# EAGLE design Final Power Supply Design PCB (EAGLE 9.6.2)
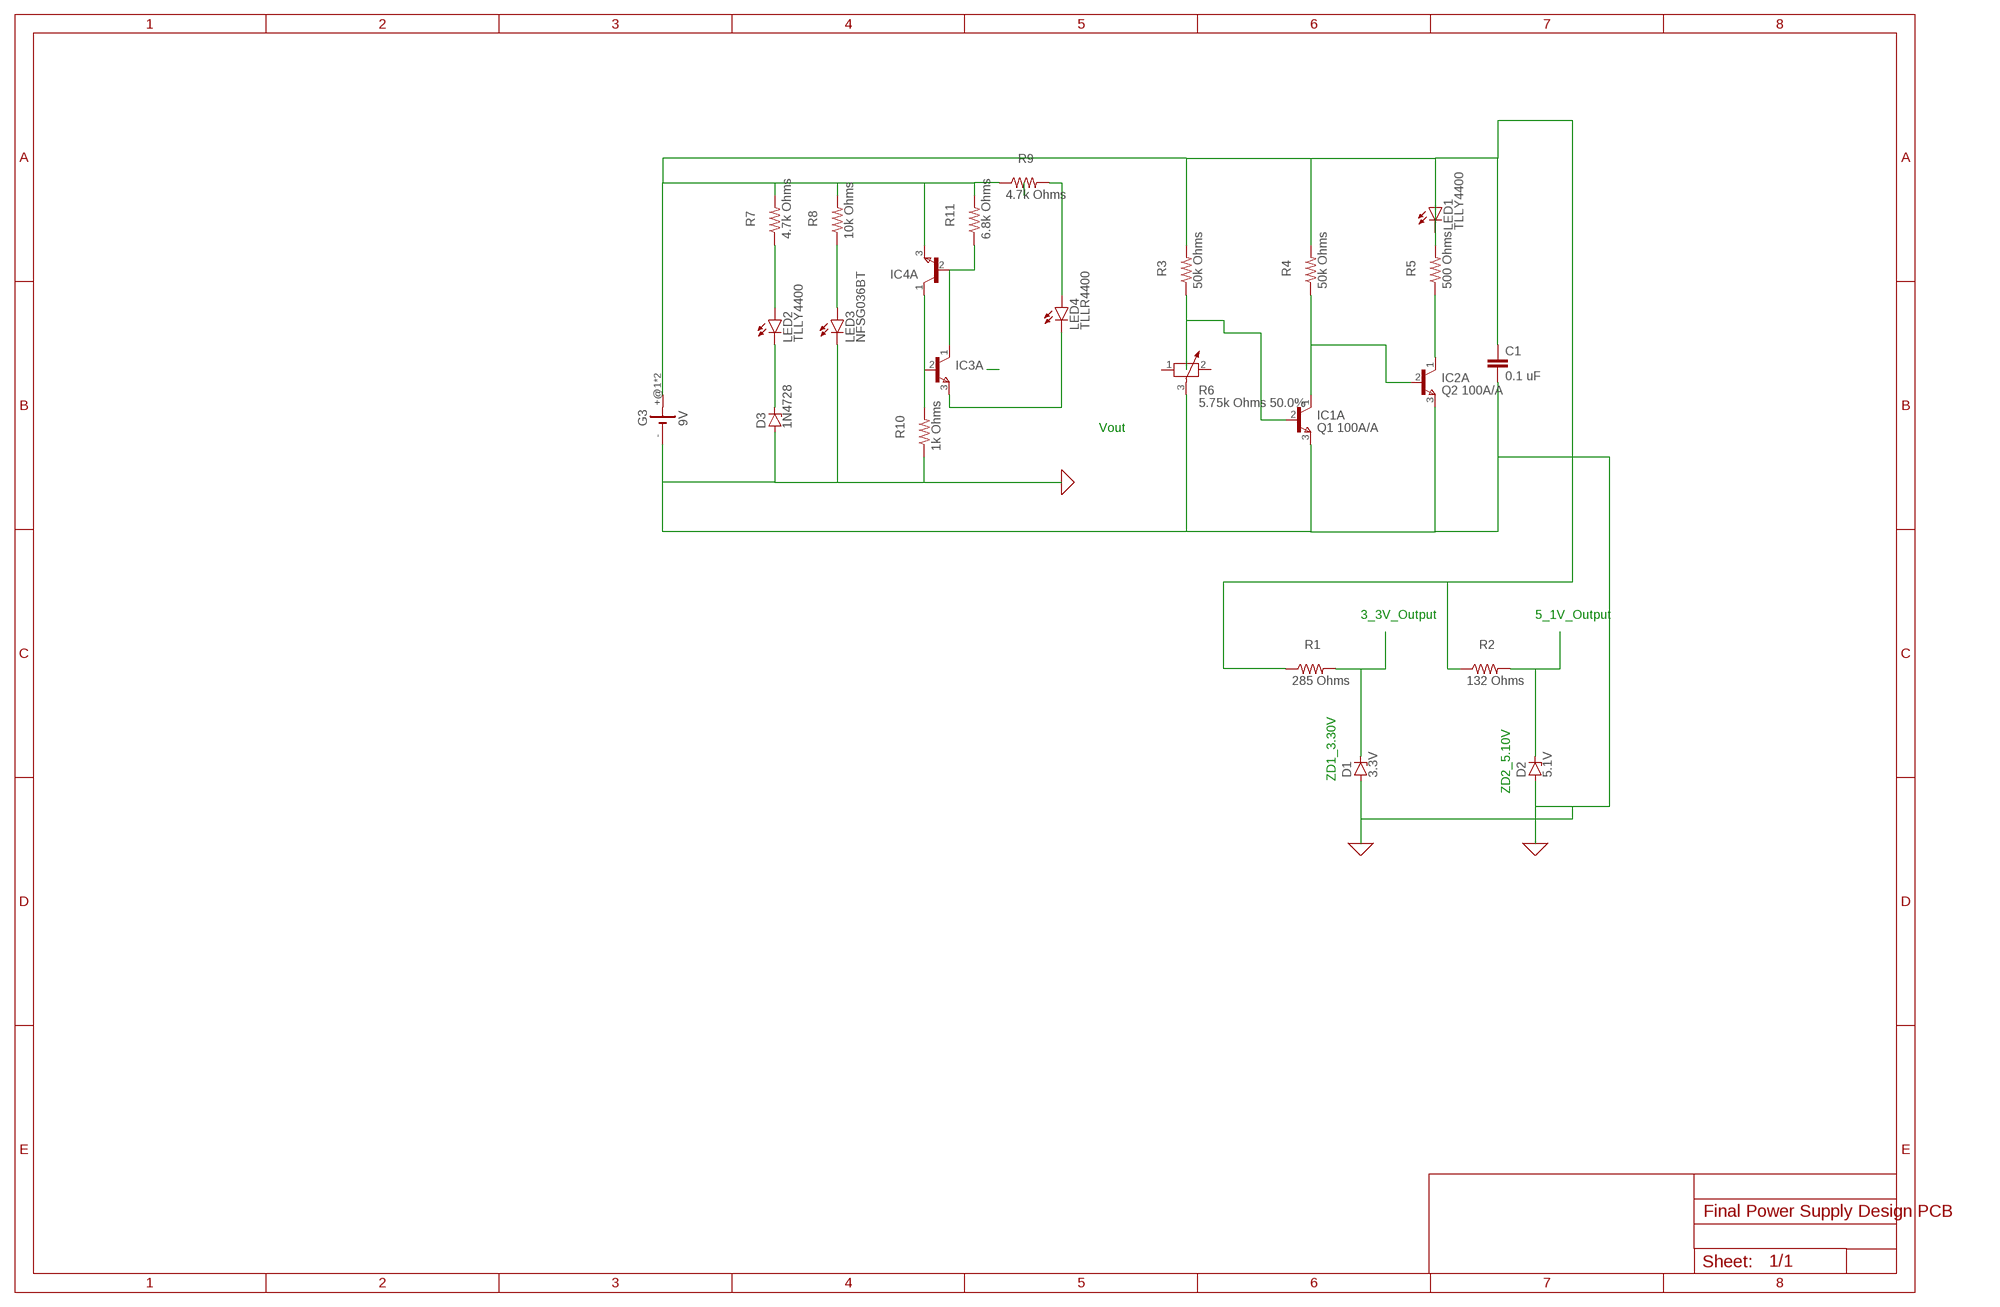
[diagram p0: schematic, sheet 1]

## Parts
C1  0.1 uF  C2.5/4  [C2.5-4]
D1  3.3V  1N4728  [DO41Z10]
D2  5.1V  1N4728  [DO41Z10]
D3  1N4728  [DO41Z10]
G3  9V  10MM_SM_COIN_CELL_CLIP  [10MM_SM_COIN_CELL_CLIP]
IC1  Q1 100A/A  MAT-01H  [TO78]
IC2  Q2 100A/A  MAT-01H  [TO78]
IC3  MAT-01H  [TO78]
IC4  MAT-01H  [TO78]
LED1  TLLY4400  [LED3MM]
LED2  TLLY4400  [LED3MM]
LED3  NFSG036BT  [NFSG036BT]
LED4  TLLR4400  [LED3MM]
R1  285 Ohms  R-US_0204/2V  [0204V]
R2  132 Ohms  R-US_0204/2V  [0204V]
R3  50k Ohms  R-US_0204/2V  [0204V]
R4  50k Ohms  R-US_0204/2V  [0204V]
R5  500 Ohms  R-US_0204/2V  [0204V]
R6  5.75k Ohms 50.0%  POTENTIOMETER_PT-10  [PT-10]
R7  4.7k Ohms  R-US_0204/2V  [0204V]
R8  10k Ohms  R-US_0204/2V  [0204V]
R9  4.7k Ohms  R-US_0204/2V  [0204V]
R10  1k Ohms  R-US_0204/2V  [0204V]
R11  6.8k Ohms  R-US_0204/2V  [0204V]

## Nets
0: C1.2 D1.A D2.A D3.A G3.- IC1.3(A:E) IC2.3(A:E) LED3.C R6.3 R10.1 ; supply symbol labelled GND
N$1: D2.C R2.2
N$2: C1.1 G3.+@1(+) G3.+@2(+) IC4.3(A:E) LED1.A LED1.K(C) R1.1 R2.1 R3.2 R4.2 R5.2 R7.2 R8.2 R9.1 R11.2
N$3: IC1.2(A:B) R3.1
N$5: IC1.1(A:C) IC2.2(A:B) R4.1
N$6: IC2.1(A:C) R5.1
N$7: LED2.A R7.1
N$8: LED3.A R8.1
N$10: D3.C LED2.K(C)
N$11: LED4.A R9.2
N$12: IC3.2(A:B) IC4.1(A:C) R10.2
N$13: IC3.1(A:C) IC4.2(A:B) R11.1
N$14: IC3.3(A:E) LED4.K(C)
N$15: D1.C R1.2
Unconnected: IC1.4(B:E) IC1.5(B:B) IC1.6(B:C) IC2.4(B:E) IC2.5(B:B) IC2.6(B:C) IC3.4(B:E) IC3.5(B:B) IC3.6(B:C) IC4.4(B:E) IC4.5(B:B) IC4.6(B:C) R6.1 R6.2

## Notes on the sheet
- Vout
- 3_3V_Output | 5_1V_Output
- ZD1_3.30V
- ZD2_5.10V

## Library data of the parts
C1 = capacitor-wima:C: CAPACITOR naming: grid - package width
D1-D3 = diode:1N4728: Z DIODE 3.3 V, 1W, 5 percent
G3 = battery:10MM_SM_COIN_CELL_CLIP: Battery cell clip for CR927 Source: KEYSTONE ELECTRONICS CORP. www.keyelco.com, ASTORIA, N.Y. 11105-2017 PART ANME 10mm SM COIN CELl CLIP DWG NO. 3030
IC1-IC4 = linear:MAT-01H: Dual TRANSISTOR
LED1 LED2 = led:TLLY4400: Low Current (2mA) LED 3 mm Tinted Diffused Package color YELLOW Source: Data sheet <http://www.farnell.com/datasheets/391098.pdf>; MF: VISHAY SEMICONDUCTOR; OC_FARNELL: 1612439
LED3 = led:NFSG036BT: CHIP TYPE GREEN LED NFSx036xT Source: NICHIA CORPORATION .. NFSG036BT-E.pdf
LED4 = led:TLLR4400: Low Current (2mA) LED 3 mm Tinted Diffused Package color RED Source: Data sheet <http://www.farnell.com/datasheets/391100.pdf>; MF: VISHAY SEMICONDUCTOR; OC_FARNELL: 1612437
R1-R5 R7-R11 = rcl:R-US_: RESISTOR, American symbol; SPICEPREFIX: R
R6 = rcl:POTENTIOMETER_: Potentiometer; SPICEMODEL: POT; SPICEPREFIX: X

## Board
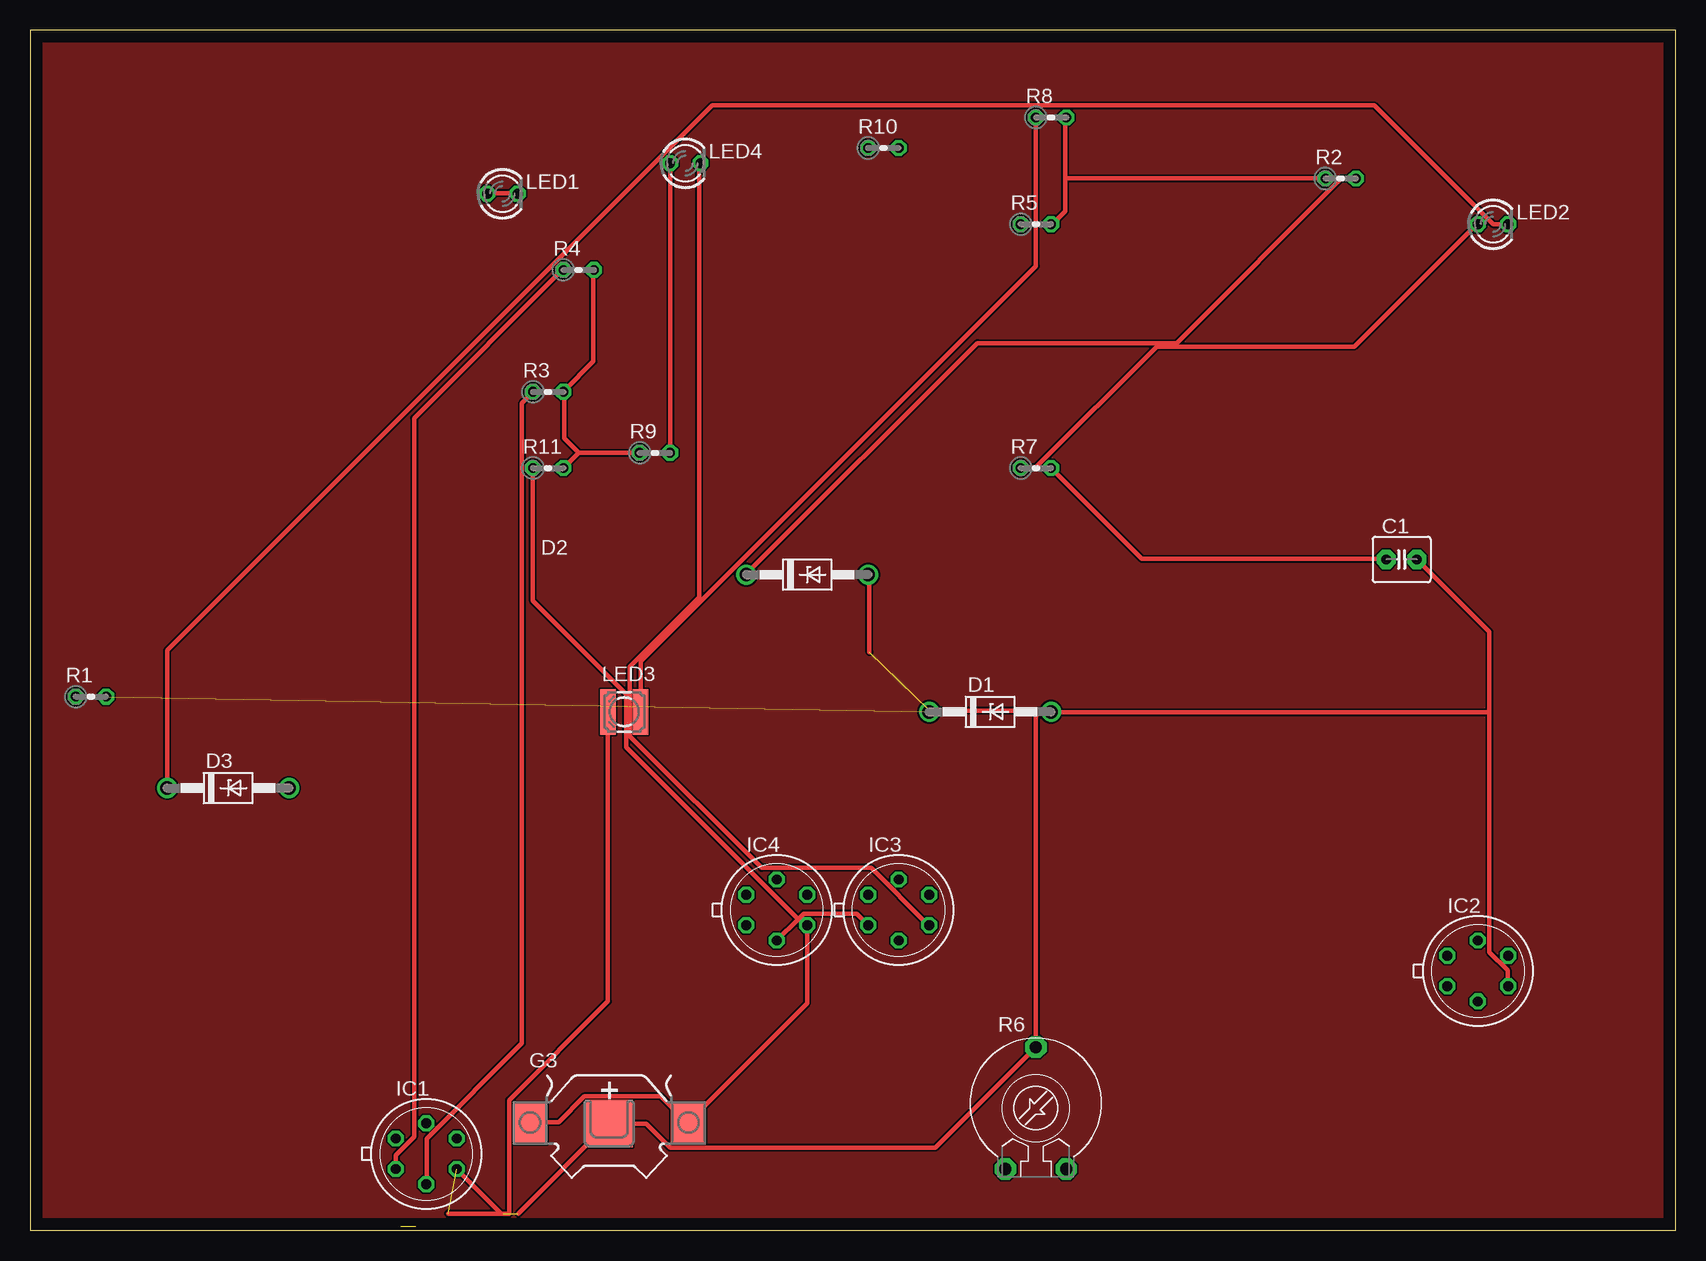
[diagram p1: board, top side]
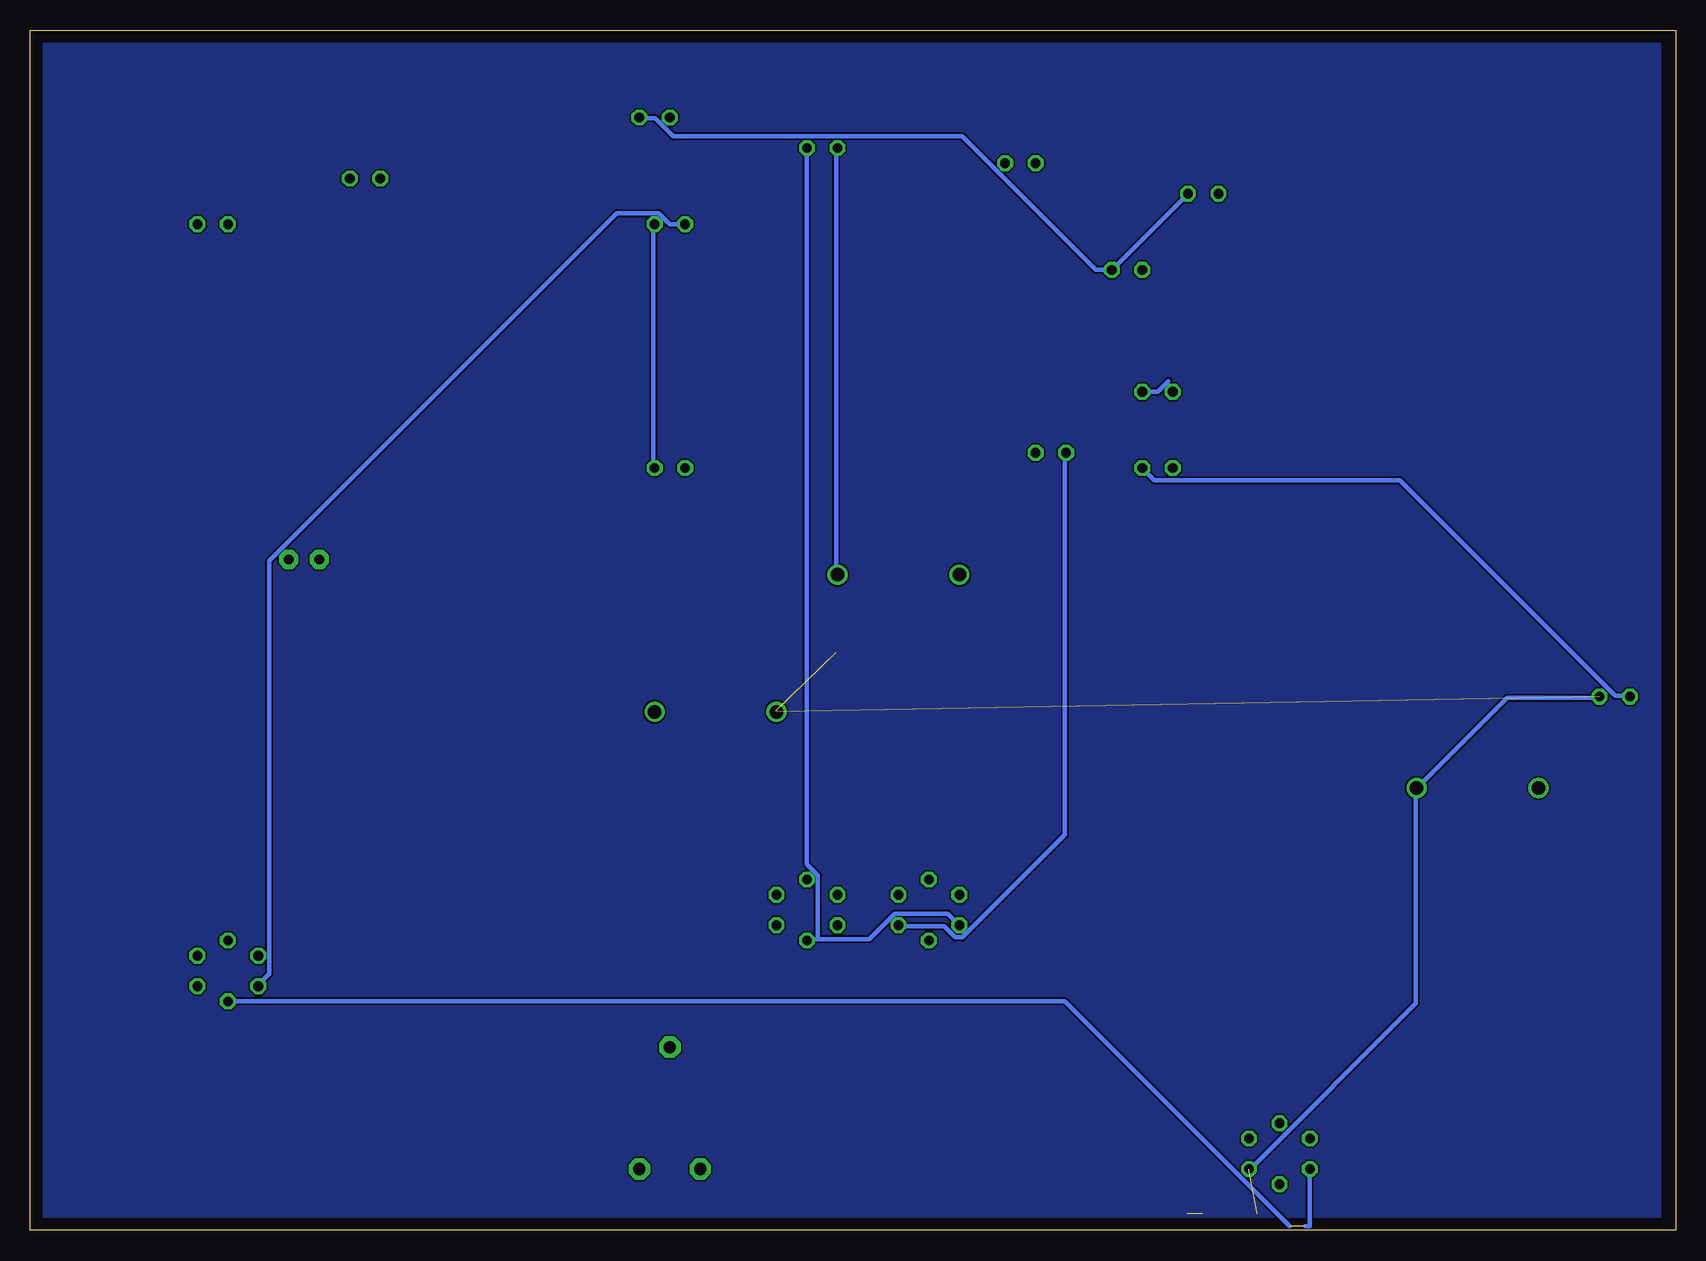
[diagram p2: board, bottom side, seen from below]

Size 137.14 x 100 mm. Coordinates in mm from the lower left corner, seen from the top.
Outline: 0,0 137.14,0 137.14,100 0,100 0,0
Copper layers (1*16): Top 0.035mm / dielectric 1.5mm / Bottom 0.035mm
Design rules "default": minimum track width 6mil, minimum drill 0.35mm, track to track 6mil, track to pad 6mil, pad to pad 6mil, via to via 6mil, smd to smd 6mil, copper to edge 40mil, drill to drill 6mil, minimum pad ring 10mil, minimum via ring 8mil, stop-mask expansion 4mil, vias tented up to drill 0mil, thermal gap 10mil

### Footprints (pad centres in the part's own frame; a part is rotated, then mirrored left to right if it is on the bottom)
C2.5-4 = drill 0.813 pad 1.6 octagon: 1 -1.27,0; 2 1.27,0
DO41Z10 = drill 1.118: A 5.08,0; C -5.08,0
10MM_SM_COIN_CELL_CLIP = smd 2.9 x 3.5: +@1 -6.6,0; +@2 6.6,0 | smd 3.96 x 3.96: - 0,0
TO78 = drill 0.813 octagon: 1 -2.54,-1.27; 2 0,-2.54; 3 2.54,-1.27; 4 2.54,1.27; 5 0,2.54; 6 -2.54,1.27
LED3MM = drill 0.813 octagon: A -1.27,0; K 1.27,0
NFSG036BT = smd 1.3 x 3.8: A 1.35,0; C -1.35,0
0204V = drill 0.813 octagon: 1 -1.27,0; 2 1.27,0
PT-10 = drill 1.016 pad 1.778 octagon: 1 -2.54,-5.08; 2 2.54,-5.08; 3 0,5.08

### Placement (x,y rotation side)
C1  114.3,55.88 0 top
D1  80.01,43.18 0 top
D2  64.77,54.61 0 top
D3  16.51,36.83 0 top
G3  48.26,8.89 0 top
IC1  33.02,6.35 0 top
IC2  120.65,21.59 0 top
IC3  72.39,26.67 0 top
IC4  62.23,26.67 0 top
LED1  39.37,86.36 0 top
LED2  121.92,83.82 0 top
LED3  49.53,43.18 0 top
LED4  54.61,88.9 0 top
R1  5.08,44.45 0 top
R2  109.22,87.63 0 top
R3  43.18,69.85 0 top
R4  45.72,80.01 0 top
R5  83.82,83.82 0 top
R6  83.82,10.16 0 top
R7  83.82,63.5 0 top
R8  85.09,92.71 0 top
R9  52.07,64.77 0 top
R10  71.12,90.17 0 top
R11  43.18,63.5 0 top

### Tracks (layer width: path | path; a pad name or v marks a point on that pad's centre or on a via)
0  (3 unrouted)
  Top 0.381: 39.42,1.37 39.27,1.37 IC1.3 | 34.85,1.37 39.93,1.37 39.93,10.82 48.16,19.05 48.16,43.13 LED3.C | 40.69,1.37 48.16,8.84 G3.- 48.31,8.84 51.36,8.84 53.34,6.86 75.44,6.86 R6.3 83.82,43.28 | 121.61,43.13 121.61,49.84 C1.2 | 121.61,43.13 121.61,23.16 123.14,21.64 123.14,20.42 IC2.3 | 83.82,43.28 85.04,43.28 D1.A 85.19,43.13 121.61,43.13 | 83.82,43.28 74.98,43.28 | 69.95,48.16 69.95,54.56 D2.A
  Bottom 0.381: 6.4,44.35 14.02,44.35 21.49,36.88 D3.A 21.64,36.73 21.64,18.9 35.51,5.03 IC1.3 | R10.1 69.95,90.07 69.95,54.71 D2.A
GND
  pour Top: 0,100.33 0,0 137.16,0 137.16,100.33
  pour Bottom (isolate 0): 1.27,100.33 1.27,0 137.16,0 137.16,100.33
N$1
  Top 0.381: R2.2 109.27,87.63 95.56,73.91 78.94,73.91 59.74,54.71 D2.C
N$2
  Top 0.381: 86.26,87.63 86.26,84.89 85.19,83.82 R5.2 | 86.26,87.63 86.26,92.66 R8.2 | 86.26,87.63 R2.1 | R7.2 92.66,55.93 112.93,55.93 C1.1 | IC4.3 64.77,18.9 54.86,8.99 G3.+@2 54.71,8.99 52.58,11.12 46.18,11.12 44.04,8.99 41.76,8.99 G3.+@1 | LED1.A 38.1,86.41 40.54,86.41 LED1.K | 45.72,64.77 R9.1 | R11.2 45.72,64.77 | 45.72,64.77 44.5,65.99 44.5,69.8 R3.2 44.5,69.95 46.94,72.39 46.94,80.01 R4.2
  Bottom 0.381: R3.2 43.17,69.85 42.28,70.74 | R7.2 85.19,63.55 85.19,83.82 R5.2 | LED1.K 40.69,86.26 46.94,80.01 R4.2 48.31,80.01 59.44,91.14 83.52,91.14 85.04,92.66 86.26,92.66 R8.2 | R11.2 43.43,62.48 23.01,62.48 5.03,44.5 3.81,44.5 R1.1 | IC4.3 64.77,25.3 60.96,25.3 60.05,24.38 59.44,24.38 50.9,32.92 50.9,64.77 R9.1
N$3
  Top 0.381: IC1.2 33.07,3.81 33.07,7.62 41,15.54 41,68.89 41.91,69.8 R3.1
N$5  (1 unrouted)
  Top 0.381: IC1.1 30.48,6.25 32,7.77 32,67.67 44.35,80.01 R4.1
  Bottom 0.381: IC2.2 50.9,19.05 32.16,0.3 | 30.89,0.3 30.48,0.3 IC1.1
N$6
  Bottom 0.381: R5.1 83.82,83.82 84.73,84.73 88.24,84.73 117.2,55.78 117.2,21.34 118.11,20.42 IC2.1
N$7
  Top 0.381: R7.1 82.6,63.55 83.82,63.55 93.88,73.61 110.34,73.61 120.55,83.82 LED2.A
N$8
  Top 0.381: R8.1 83.82,80.31 50.9,47.4 50.9,43.28 LED3.A
N$10
  Top 0.381: LED2.K 121.92,83.82 112.01,93.73 56.84,93.73 11.43,48.31 D3.C
N$11
  Top 0.381: LED4.A R9.2
N$12
  Bottom 0.381: 71.48,24.23 67.21,24.23 65.08,26.36 60.66,26.36 IC4.1 | 71.48,24.23 72.39,24.23 IC3.2 | R10.2 72.39,30.48 71.48,29.57 71.48,24.23
N$13
  Top 0.381: 64.01,25.91 64.47,26.36 68.89,26.36 IC3.1 | 64.01,25.91 IC4.2 | R11.1 41.91,52.43 49.68,44.65 49.68,40.23 64.01,25.91
N$14
  Top 0.381: LED4.K 55.78,88.85 55.78,52.73 49.99,46.94 49.99,41.15 60.96,30.18 70.1,30.18 74.83,25.45 IC3.3
N$15  (1 unrouted)